# Altium schematic sheet power_mux.SchDoc
size A4; SheetNumber: 6; SheetTotal: 11
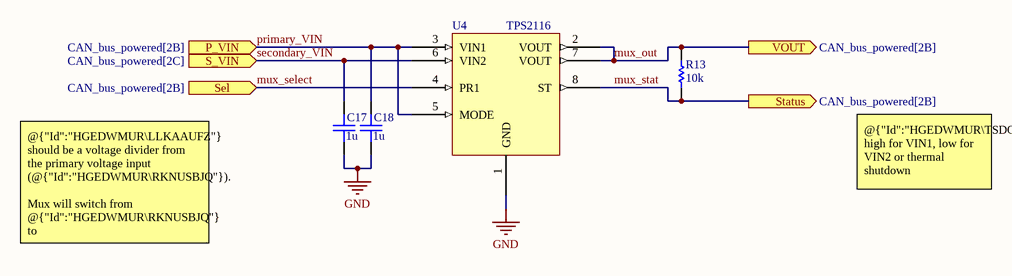
[diagram p0: power_mux.SchDoc]

## Parts
C17  1u  [CAP-0603-NP]
C18  1u  [CAP-0603-NP]
R13  10k  [RES-0603]
U4  TPS2116  [SOT-5x3]

## Ports
P_VIN (in, see CAN_bus_powered[2B]), S_VIN (in, see CAN_bus_powered[2C]), Sel (in, see CAN_bus_powered[2B]), Status (out, see CAN_bus_powered[2B]), VOUT (out, see CAN_bus_powered[2B])

## Nets
GND: C17.1 C18.1 U4.1(GND)
mux_out: R13.2 U4.2(VOUT) U4.7(VOUT) ; port VOUT
mux_select: U4.4(PR1) ; port Sel
mux_stat: R13.1 U4.8(ST) ; port Status
primary_VIN: C18.2 U4.3(VIN1) U4.5(MODE) ; port P_VIN
secondary_VIN: C17.2 U4.6(VIN2) ; port S_VIN

## Notes on the sheet
- @{"Id":"HGEDWMUR\TSDOJRFR"}: high for VIN1, low for VIN2 or thermal shutdown
- @{"Id":"HGEDWMUR\LLKAAUFZ"} should be a voltage divider from the primary voltage input (@{"Id":"HGEDWMUR\RKNUSBJQ"}).
  Mux will switch from @{"Id":"HGEDWMUR\RKNUSBJQ"} to @{"Id":"HGEDWMUR\STDIKBVV"} when the voltage at sel is less than 1V.

## Library data of the parts
C17 C18 = Capacitor
R13 = Resistor
U4 = TPS2116: 1.6 V to 5.5 V, 2.5-A Low IQ Power Mux with Manual and Priority Switchover